# Altium schematic sheet overview.SchDoc: Sensors
size A4; ApprovedBy: Othniel Konan; CheckedBy: Othniel Konan; Author: Othniel Konan; DrawnBy: Othniel Konan; Engineer: Othniel Konan; Address1: NPSC; Address2: Othniel Konan; Address3: ECE 2017; DocumentNumber: 1; Revision: 1.0; SheetNumber: 1; SheetTotal: 1; ProjectName: NPSC
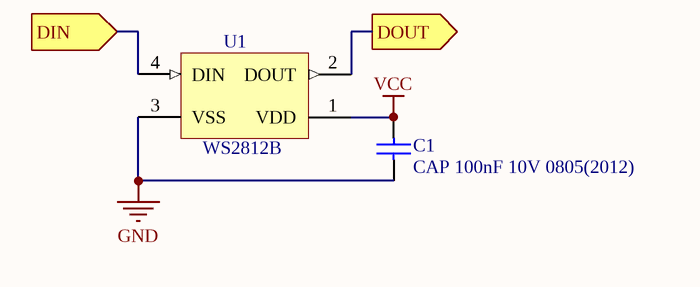
[diagram p0: overview.SchDoc]

## Parts
C1  CAP 100nF 10V 0805(2012)  [CAPC0805(2012)100_L]
U1  WS2812B  [ADAI-WS2812B_V]

## Ports
DIN (in), DOUT (out)

## Nets
GND: C1.1 U1.3(VSS)
VCC: C1.2 U1.1(VDD)
DIN: U1.4(DIN) ; port DIN
DOUT: U1.2(DOUT) ; port DOUT

## Notes on the sheet
- Title
- Size:
- Date:
- A4
- Number:
- Time:
- Revision:
- Sheet
- of
- File:

## Library data of the parts
C1 = CMP-1036-00005-1: CAP 0.5pF 10V ±0.5pF 0805 (2012 Metric) Thickness 1mm SMD; Case-Metric: 2012; Case-EIA: 0805; Tolerance: Â±0.5pF; Rated Voltage: 10 V; Max Thickness: 1 mm; Technology: SMT; Value: 0.5pF
U1 = CMP-1740-00005-1: Intelligent Control LED Integrated Light Source, 3.5 to 5.3 V, -25 to 80 degC, 4-Pin SMD, RoHS, Bulk; Case\Package: Radial; Shielding: Unshielded; Current Rating: 240 mA; Tolerance: 10%; Mount: Through Hole; Max Operating Temperature: 125 degC; Radiation Hardening: No; Length: 12.2 mm; Min Operating Temperature: -55 degC; ComponentLink1URL: https://www.adafruit.com/; Packaging: Bulk; Lead Pitch: 5 mm; RoHSCompliant: true; Pins: 2; Package Quantity: 200; ComponentLink2URL: https://cdn-shop.adafruit.com/datasheets/WS2812B.pdf; ComponentLink2Description: Datasheet; PackageDescription: 4-Pin Surface Mount Device, Body 5 x 5 mm, Pitch 3.3 mm; PackageReference: WS2812B; Height: 12.2 mm; REACH SVHC: No SVHC; ComponentLink1Description: Manufacturer URL; DatasheetVersion: May-13